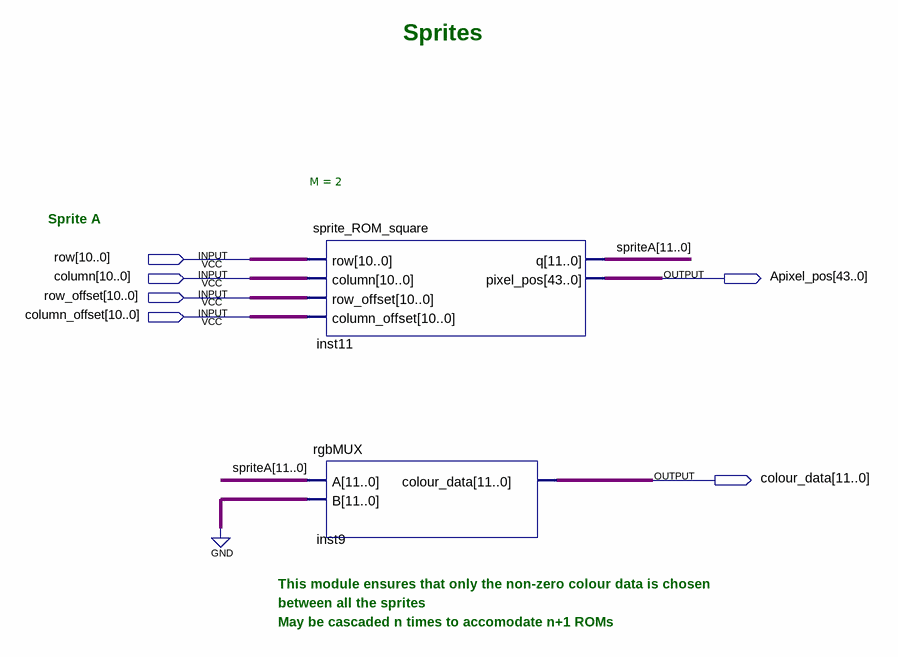
[diagram p0: schematic sheet]
// Quartus schematic sprites.bdf as structural Verilog: 2 symbols, 6 pins
module sprites (
  input  [10:0] row,
  input  [10:0] column,
  input  [10:0] row_offset,
  input  [10:0] column_offset,
  output [43:0] Apixel_pos,
  output [11:0] colour_data
);

  wire [11:0] spriteA;

  sprite_ROM_square #(.M(2)) inst11 (
    .row(row), .column(column), .row_offset(row_offset), .column_offset(column_offset), .q(spriteA),
    .pixel_pos(Apixel_pos));
  rgbMUX inst9 (.A(spriteA), .B({12{1'b0}}), .colour_data(colour_data));

  // Notes on the sheet:
  //   Sprites
  //   Sprite A
  //   This module ensures that only the non-zero colour data is chosen
  //   between all the sprites
  //   May be cascaded n times to accomodate n+1 ROMs
endmodule
